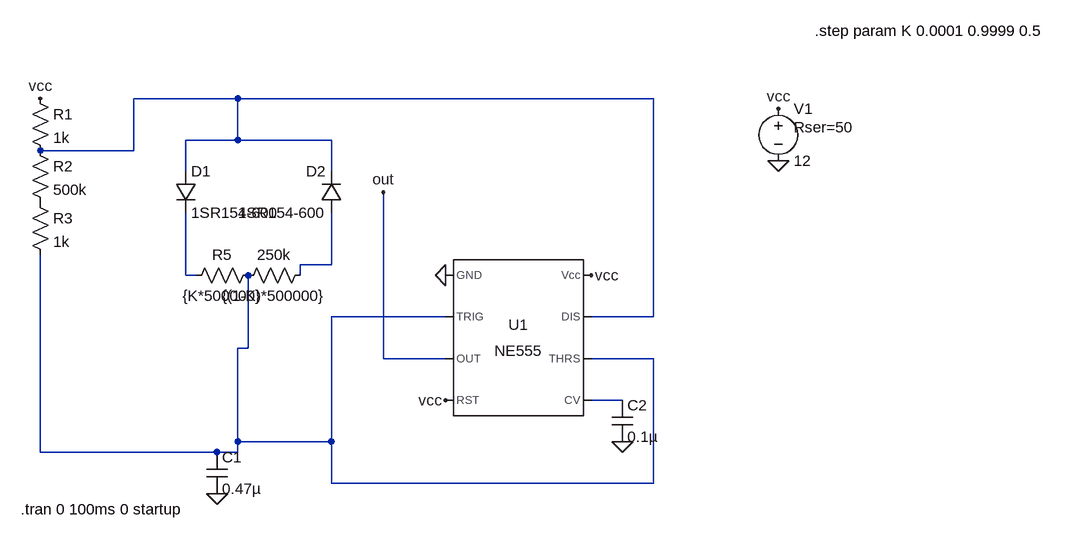
[diagram p0: schematic osilador con preset, vatante independiete.asc]
osilador con preset, vatante independiete.asc, the LTspice schematic file:
Version 4
SHEET 1 1148 680
WIRE -208 -208 -368 -208
WIRE 432 -208 -208 -208
WIRE -208 -144 -208 -208
WIRE -208 -144 -288 -144
WIRE -64 -144 -208 -144
WIRE -368 -128 -368 -208
WIRE -368 -128 -512 -128
WIRE -288 -96 -288 -144
WIRE -64 -96 -64 -144
WIRE -64 48 -64 -32
WIRE -64 48 -112 48
WIRE -288 64 -288 -32
WIRE -272 64 -288 64
WIRE -112 64 -112 48
WIRE 112 128 -64 128
WIRE 432 128 432 -208
WIRE 432 128 336 128
WIRE -192 176 -192 64
WIRE -192 176 -208 176
WIRE 16 192 16 -64
WIRE 112 192 16 192
WIRE 432 192 336 192
WIRE 384 256 336 256
WIRE -208 320 -208 176
WIRE -64 320 -64 128
WIRE -64 320 -208 320
WIRE -512 336 -512 32
WIRE -240 336 -512 336
WIRE -208 336 -208 320
WIRE -208 336 -240 336
WIRE -64 384 -64 320
WIRE 432 384 432 192
WIRE 432 384 -64 384
FLAG 112 64 0
FLAG 336 64 vcc
FLAG -240 400 0
FLAG -512 -208 vcc
FLAG 384 320 0
FLAG 112 256 vcc
FLAG 16 -64 out
FLAG 624 -112 0
FLAG 624 -192 vcc
SYMBOL Misc\\NE555 224 160 R0
SYMATTR InstName U1
SYMBOL res -528 -224 R0
SYMATTR InstName R1
SYMATTR Value 1k
SYMBOL res -528 -144 R0
SYMATTR InstName R2
SYMATTR Value 500k
SYMBOL res -528 -64 R0
SYMATTR InstName R3
SYMATTR Value 1k
SYMBOL cap -256 336 R0
SYMATTR InstName C1
SYMATTR Value 0.47µ
SYMBOL res -96 48 R90
WINDOW 0 0 56 VBottom 2
WINDOW 3 32 56 VTop 2
SYMATTR InstName 250k
SYMATTR Value {(1-K)*500000}
SYMBOL res -176 48 R90
WINDOW 0 0 56 VBottom 2
WINDOW 3 32 56 VTop 2
SYMATTR InstName R5
SYMATTR Value {K*500000}
SYMBOL diode -304 -96 R0
SYMATTR InstName D1
SYMATTR Value 1SR154-600
SYMBOL cap 368 256 R0
SYMATTR InstName C2
SYMATTR Value 0.1µ
SYMBOL voltage 624 -208 R0
WINDOW 123 0 0 Left 0
WINDOW 39 24 44 Left 2
SYMATTR InstName V1
SYMATTR Value 12
SYMATTR SpiceLine Rser=50
SYMBOL diode -48 -32 R180
WINDOW 0 24 64 Left 2
WINDOW 3 24 0 Left 2
SYMATTR InstName D2
SYMATTR Value 1SR154-600
TEXT -542 424 Left 2 !.tran 0 100ms 0 startup
TEXT 680 -312 Left 2 !.step param K 0.0001 0.9999 0.5

The netlist it stands for:
* osilador con preset, vatante independiete.asc
XU1 0 N004 out vcc N005 N004 N001 vcc NE555  ; pins GND TRIG OUT RST CV THRS DIS Vcc
R1 vcc N001 1k
R2 N001 P001 500k
R3 P001 N004 1k
C1 N004 0 0.47µ
R§250k N002 N004 {(1-K)*500000}
R5 N004 N003 {K*500000}
D1 N001 N003 1SR154-600
C2 N005 0 0.1µ
V1 vcc 0 12 Rser=50
D2 N002 N001 1SR154-600
.model D D
.lib standard.dio
.tran 0 100ms 0 startup
.step param K 0.0001 0.9999 0.5
.lib NE555.sub
.backanno
.end